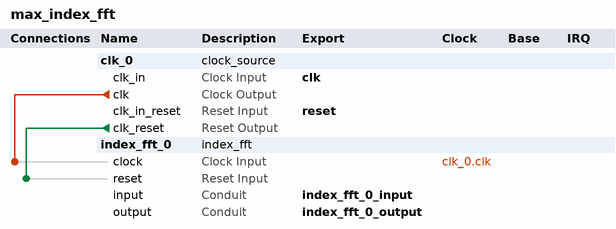
[diagram p0: system contents]
# Platform Designer (Qsys) system max_index_fft, MAX 10 10M50DAF484C6GES
# Parameters at their usual value, and those the tool derives, are not listed.
package require -exact qsys 20.1
create_system max_index_fft
set_project_property DEVICE_FAMILY {MAX 10}
set_project_property DEVICE 10M50DAF484C6GES

add_instance clk_0 clock_source 20.1
set_instance_parameter_value clk_0 clockFrequency 50000000

add_instance index_fft_0 index_fft 1.0

# connections
add_connection clk_0.clk index_fft_0.clock clock
add_connection clk_0.clk_reset index_fft_0.reset reset

# exported interfaces
add_interface clk clock sink
set_interface_property clk EXPORT_OF clk_0.clk_in
add_interface index_fft_0_input conduit end
set_interface_property index_fft_0_input EXPORT_OF index_fft_0.input
add_interface index_fft_0_output conduit end
set_interface_property index_fft_0_output EXPORT_OF index_fft_0.output
add_interface reset reset sink
set_interface_property reset EXPORT_OF clk_0.clk_in_reset

set_interconnect_requirement {$system} qsys_mm.clockCrossingAdapter HANDSHAKE
set_interconnect_requirement {$system} qsys_mm.enableEccProtection FALSE
set_interconnect_requirement {$system} qsys_mm.insertDefaultSlave FALSE
set_interconnect_requirement {$system} qsys_mm.maxAdditionalLatency 1

save_system max_index_fft.qsys
